# Altium project Arduino and Sensors.PrjPcb
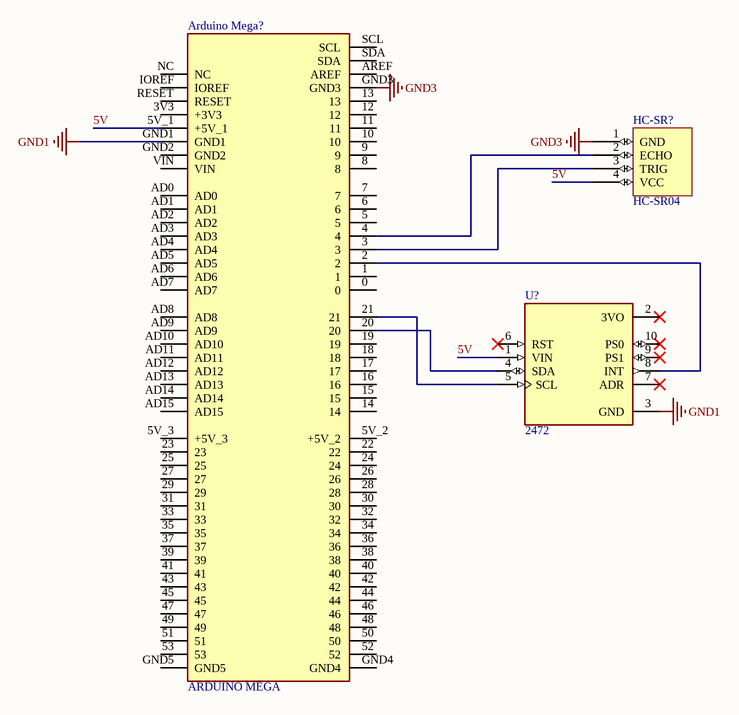
[diagram p0: ArduinoAndSensorsSCH.SchDoc]
1 sheet, 3 parts. Net scope: global (net labels, ports and power ports of the same name join across sheets).
Board file: ArduinoAndSensorsPCB.PcbDoc

## Sheet ArduinoAndSensorsSCH.SchDoc
size A; SheetNumber: 1; SheetTotal: 1

### Parts
Adafruit_BNO055  2472  [MODULE_2472]
Arduino_Mega  ARDUINO MEGA  [ARDUINO_A000067]
HC-SR04  HC-SR04  [PCBComponent_1]

### Nets
GND1: Adafruit_BNO055.3(GND) Arduino_Mega.GND1
GND3: Arduino_Mega.GND3 HC-SR04.1(GND)
5V: Adafruit_BNO055.1(VIN) Arduino_Mega.5V_1(+5V_1) HC-SR04.4(VCC)
NetAdafruit_BNO055_4: Adafruit_BNO055.4(SDA) Arduino_Mega.20
NetAdafruit_BNO055_5: Adafruit_BNO055.5(SCL) Arduino_Mega.21
NetAdafruit_BNO055_8: Adafruit_BNO055.8(INT) Arduino_Mega.2
NetArduino_Mega_3: Arduino_Mega.3 HC-SR04.3(TRIG)
NetArduino_Mega_4: Arduino_Mega.4 HC-SR04.2(ECHO)

Not connected (* = marked no-connect by the designer): Adafruit_BNO055 2(3VO)* 6(RST)* 7(ADR)* 9(PS1)* 10(PS0)*; Arduino_Mega 0 1 3V3(+3V3) 5 5V_2(+5V_2) 5V_3(+5V_3) 6 7 8 9 10 11 12 13 14 15 16 17 18 19 22 23 24 25 26 27 28 29 30 31 32 33 34 35 36 37 38 39 40 41 42 43 44 45 46 47 48 49 50 51 52 53 AD0 AD1 AD2 AD3 AD4 AD5 AD6 AD7 AD8 AD9 AD10 AD11 AD12 AD13 AD14 AD15 AREF GND2 GND4 GND5 IOREF NC RESET SCL SDA VIN

### Library data of the parts
Adafruit_BNO055 = 2472: Adafruit 9-DOF Absolute Orientation IMU Fusion Breakout - BNO055 | Adafruit Industries 2472
Arduino_Mega = A000067: 8-bit board with 54 digital pins, 16 analog inputs, and 4 serial ports.; MP: Arduino Mega 2560 Rev3
HC-SR04 = Component_1